# EAGLE design PRES (EAGLE 5.06)
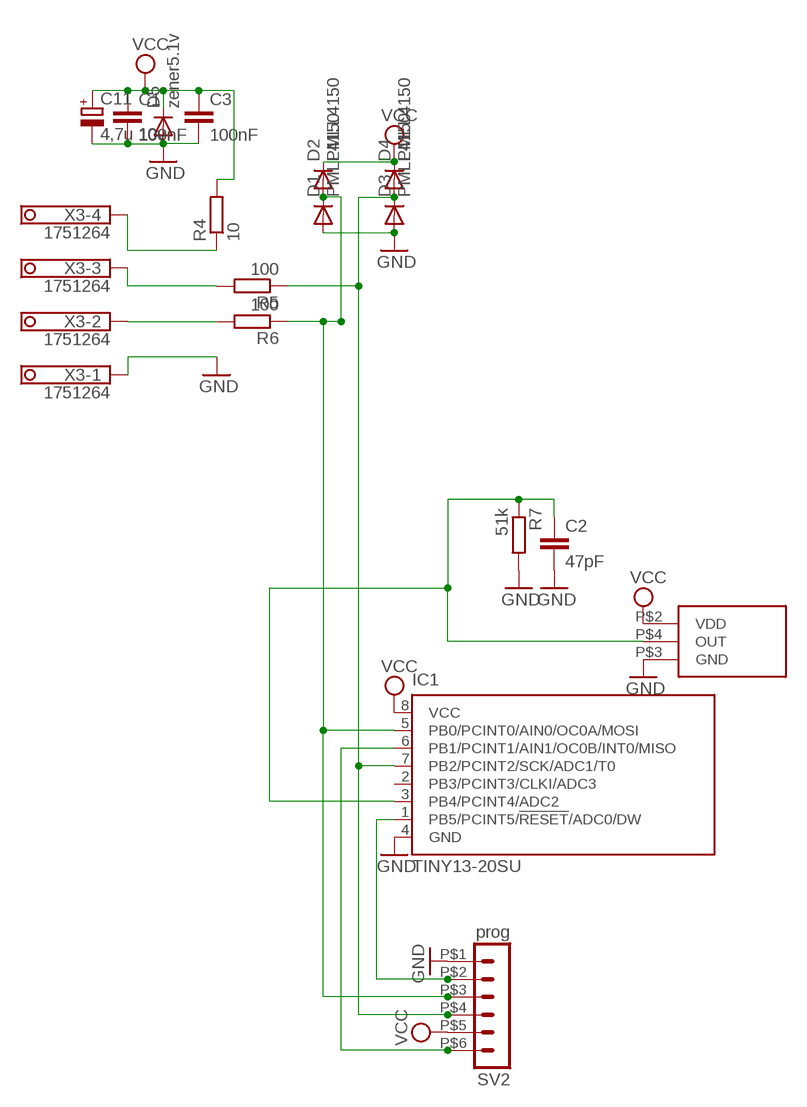
[diagram p0: schematic, sheet 1]

## Parts
C1  100nF  C-EUC0805  [C0805]
C2  47pF  C-EUC0805  [C0805]
C3  100nF  C-EUC0805  [C0805]
C11  4,7u 10v  CPOL-EUB/3528-21R  [B/3528-21R]
D1  PMLL4150  [SOD80C]
D2  PMLL4150  [SOD80C]
D3  PMLL4150  [SOD80C]
D4  PMLL4150  [SOD80C]
D5  zener5.1v  PMLL4150  [SOD80C]
IC1  TINY13-20SU  [8S2]
R4  10  R-EU_R0805  [R0805]
R5  100  R-EU_R1206  [R1206]
R6  100  R-EU_R1206  [R1206]
R7  51k  R-EU_R1206  [R1206]
SV2  prog  MA06-1'  [MA06-1_SMD_MINI]
U$1  MPXHZA6115A  [8LD]
X3  1751264  [1751264]

## Nets
GND: C1.2 C2.2 C3.2 C11.- D1.A D3.A D5.A IC1.4(GND) R7.2 SV2.P$1 U$1.P$3(GND) X3.1
MISO: IC1.6(PB1/PCINT1/AIN1/OC0B/INT0/MISO) SV2.P$6
MOSI: D1.C D2.A IC1.5(PB0/PCINT0/AIN0/OC0A/MOSI) R6.1 SV2.P$3
N$1: IC1.1(PB5/PCINT5/!RESET!/ADC0/DW) SV2.P$2
N$15: C2.1 IC1.3(PB4/PCINT4/ADC2) R7.1 U$1.P$4(OUT)
N$16: R6.2 X3.2
N$17: R5.2 X3.3
N$18: R4.1 X3.4
SCK: D3.C D4.A IC1.7(PB2/PCINT2/SCK/ADC1/T0) R5.1 SV2.P$4
VCC: C1.1 C3.1 C11.+ D2.C D4.C D5.C IC1.8(VCC) R4.2 SV2.P$5 U$1.P$2(VDD)
Unconnected: IC1.2(PB3/PCINT3/CLKI/ADC3)

## Library data of the parts
C1-C3 = rcl:C-EU: CAPACITOR, European symbol
C11 = rcl:CPOL-EU: POLARIZED CAPACITOR, European symbol
D1-D5 = diode:PMLL4150: DIODE high speed
IC1 = atmel:TINY13: 8-bit AVR Microcontroller with 1K Bytes In-System Programmable Flash Source: http://www.atmel.com/dyn/resources/prod_documents/2535S.pdf
R4-R7 = rcl:R-EU_: RESISTOR, European symbol
SV2 = con-lstb:MA06-1: PIN HEADER
U$1 = freescale:MPXHZA6115A
X3 = con-phoenix-350:1751264: MKDS 1/ 4-3,5 Printklemme Nennstrom: 10 A Bemessungsspannung: 160 V Raster: 3,5 mm Polzahl: 4 Montageart: Löten Anschlussart: Schraubanschluss Anschlussrichtung vom Leiter zur Platine: 0° Source: http://eshop.phoenixcontact.com .. 1751264.pdf

## Board
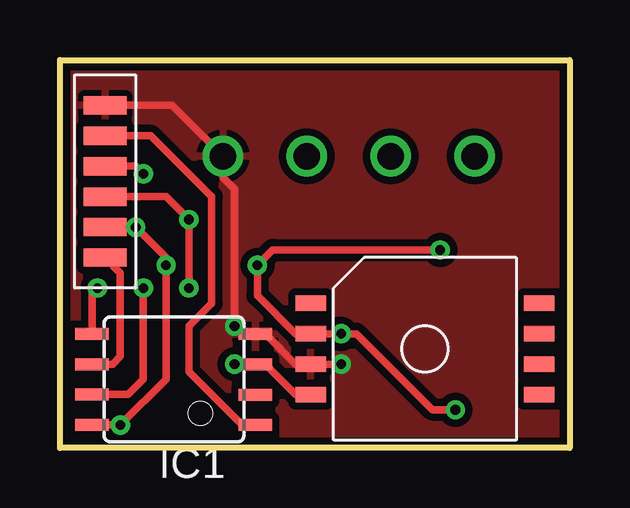
[diagram p1: board, top side]
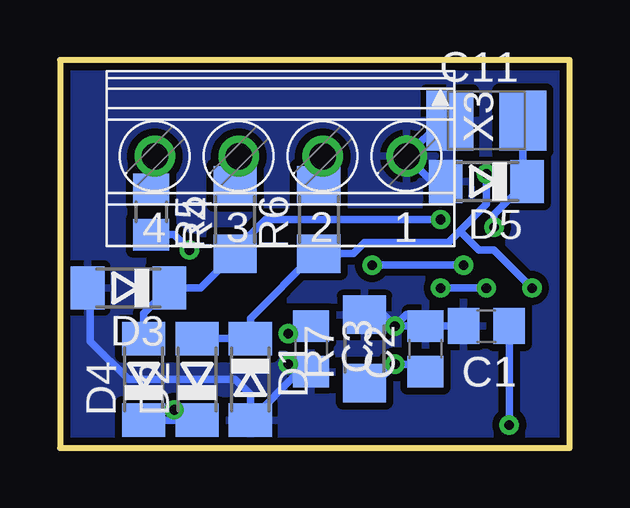
[diagram p2: board, bottom side, seen from below]

Size 21.25 x 16.18 mm. Coordinates in mm from the lower left corner, seen from the top.
Outline: 21.25,0 0,0 0,16.18 21.25,16.18 21.25,0
Copper layers (1*16): Top 0.035mm / dielectric 1.5mm / Bottom 0.035mm
Design rules "default *": minimum track width 10mil, minimum drill 0.4mm, track to track 8mil, track to pad 8mil, pad to pad 8mil, via to via 8mil, smd to smd 0mil, copper to edge 10mil, drill to drill 8mil, minimum pad ring 10mil, minimum via ring 8mil, stop-mask expansion 4mil, vias tented up to drill 0mil, thermal gap 10mil

### Footprints (pad centres in the part's own frame; a part is rotated, then mirrored left to right if it is on the bottom)
C0805 = smd 1.3 x 1.5: 1 -0.95,0; 2 0.95,0
B/3528-21R = smd 1.95 x 2.5: + 1.525,0; - -1.525,0
SOD80C = smd 1.4 x 1.8: A 1.7,0; C -1.7,0
8S2 = smd 0.5 x 1.4: 1 -1.905,-3.404; 2 -0.645,-3.404; 3 0.625,-3.404; 4 1.895,-3.404; 5 1.905,3.404; 6 0.635,3.404; 7 -0.635,3.404; 8 -1.905,3.404
R0805 = smd 1.3 x 1.5: 1 -0.95,0; 2 0.95,0
R1206 = smd 1.6 x 1.803: 1 -1.422,0; 2 1.422,0
MA06-1_SMD_MINI = smd 0.762 x 1.778: P$1 -3.81,0; P$2 -2.54,0; P$3 -1.27,0; P$4 0,0; P$5 1.27,0; P$6 2.54,0
8LD = smd 1.27 x 0.635: P$1 4.763,-1.905; P$2 4.763,-0.635; P$3 4.763,0.635; P$4 4.763,1.905; P$5 -4.763,1.905; P$6 -4.763,0.635; P$7 -4.763,-0.635; P$8 -4.763,-1.905
1751264 = drill 1.1 pad 1.7 round: 1 -5.25,-0.1; 2 -1.75,-0.1; 3 1.75,-0.1; 4 5.25,-0.1

### Placement (x,y rotation side)
C1  3.47,5.08 180 bottom
C2  6.01,4.13 90 bottom
C3  10.77,4.13 270 bottom
C11  3.47,13.65 0 bottom
D1  13.31,2.86 270 bottom
D2  15.54,2.86 90 bottom
D3  18.39,6.67 180 bottom
D4  17.76,2.86 90 bottom
D5  3.47,11.11 180 bottom
IC1  4.74,2.86 90 top
R4  17.44,9.84 270 bottom
R5  13.95,9.53 90 bottom
R6  10.46,9.53 90 bottom
R7  8.55,4.13 90 bottom
SV2  1.88,10.48 270 top
U$1  15.22,4.13 180 top
X3  12.05,12.07 180 bottom

### Tracks (layer width: path | path; a pad name or v marks a point on that pad's centre or on a via)
GND  (via drill 0.4)
  Top 0.305: v11.73,3.49 U$1.P$3 9.82,3.49 8.56,4.75 IC1.4 7.61,4.75 v7.28,5.08 7.28,10.79 6.8,11.28 X3.1 4.67,14.29 SV2.P$1
  Bottom 0.305: v7.28,5.08 C2.2 C1.2 | R7.2 7.75,5.55 v7.28,5.08 | v11.73,3.49 11.09,3.49 C3.2 11.3,3.18 D1.A 13.32,2.22 13.95,2.86 18.4,2.86 19.98,4.44 19.98,6.55 D3.A | v7.28,5.08 6.8,5.57 | C11.- 5.31,13.65 X3.1 5.74,11.11 D5.A
  pour Bottom (isolate 0.305): -0.02,16.19 21.25,16.19 21.25,0 -0.02,0
  pour Top (isolate 0.305): -0.02,16.51 21.25,16.19 21.25,0 -0.02,0.32
MISO
  Top 0.305: IC1.6 2.2,3.49 2.52,3.81 2.52,7.3 SV2.P$6
MOSI  (via drill 0.4)
  Top 0.305: SV2.P$3 3.16,11.75 v3.47,11.43 | IC1.5 1.34,6.44 v1.57,6.67
  Bottom 0.305: v3.47,11.43 3.47,10.16 4.58,9.05 | 4.58,9.05 5.06,8.57 8.55,8.57 9.02,8.1 R6.1 10.61,8.1 13.32,5.4 D1.C D2.A | v1.57,6.67 3.16,8.26 3.79,8.26 4.58,9.05
N$1
  Top 0.305: SV2.P$2 3.79,13.02 6.33,10.48 6.33,6.03 5.38,5.08 5.38,3.18 7.6,0.95 IC1.1
N$15  (via drill 0.4)
  Top 0.305: U$1.P$4 9.82,2.22 8.56,3.48 IC1.3 v7.29,3.48 v7.28,3.49
  Bottom 0.305: C2.1 6.33,3.49 v7.28,3.49 8.07,2.71 R7.1
N$16
  Bottom 0.305: R6.2 10.46,12 X3.2
N$17
  Bottom 0.305: X3.3 13.8,11.1 R5.2
N$18
  Bottom 0.305: R4.1 17.44,12.02 X3.4
SCK  (via drill 0.4)
  Top 0.305: SV2.P$4 4.43,10.48 v5.38,9.53 v5.38,6.67 | IC1.7 2.84,2.22 3.47,2.86 v3.47,6.67
  Bottom 0.305: v5.38,9.53 12.68,9.53 13.95,8.26 R5.1 15.39,6.67 D3.C 17.76,5.6 D4.A | v3.47,6.67 v5.38,6.67
VCC  (via drill 0.4)
  Top 0.305: SV2.P$5 v3.16,9.21 4.43,7.94 v4.43,7.62 4.43,2.86 v2.52,0.95 IC1.8 | v15.85,8.26 8.87,8.26 v8.24,7.62 8.24,6.35 9.82,4.76 U$1.P$2 v11.73,4.76 12.36,4.76 15.54,1.59 v16.49,1.59
  Bottom 0.305: v11.73,4.76 11.09,4.76 C3.1 | C11.+ 1.95,11.29 D5.C 3.16,9.73 v3.16,9.21 | v4.43,7.62 v8.24,7.62 | v2.52,0.95 C1.1 | D4.C D2.C 16.06,1.16 v16.49,1.59 | R4.2 16.49,8.89 v15.85,8.26